# Altium project TCC01.PrjPcb
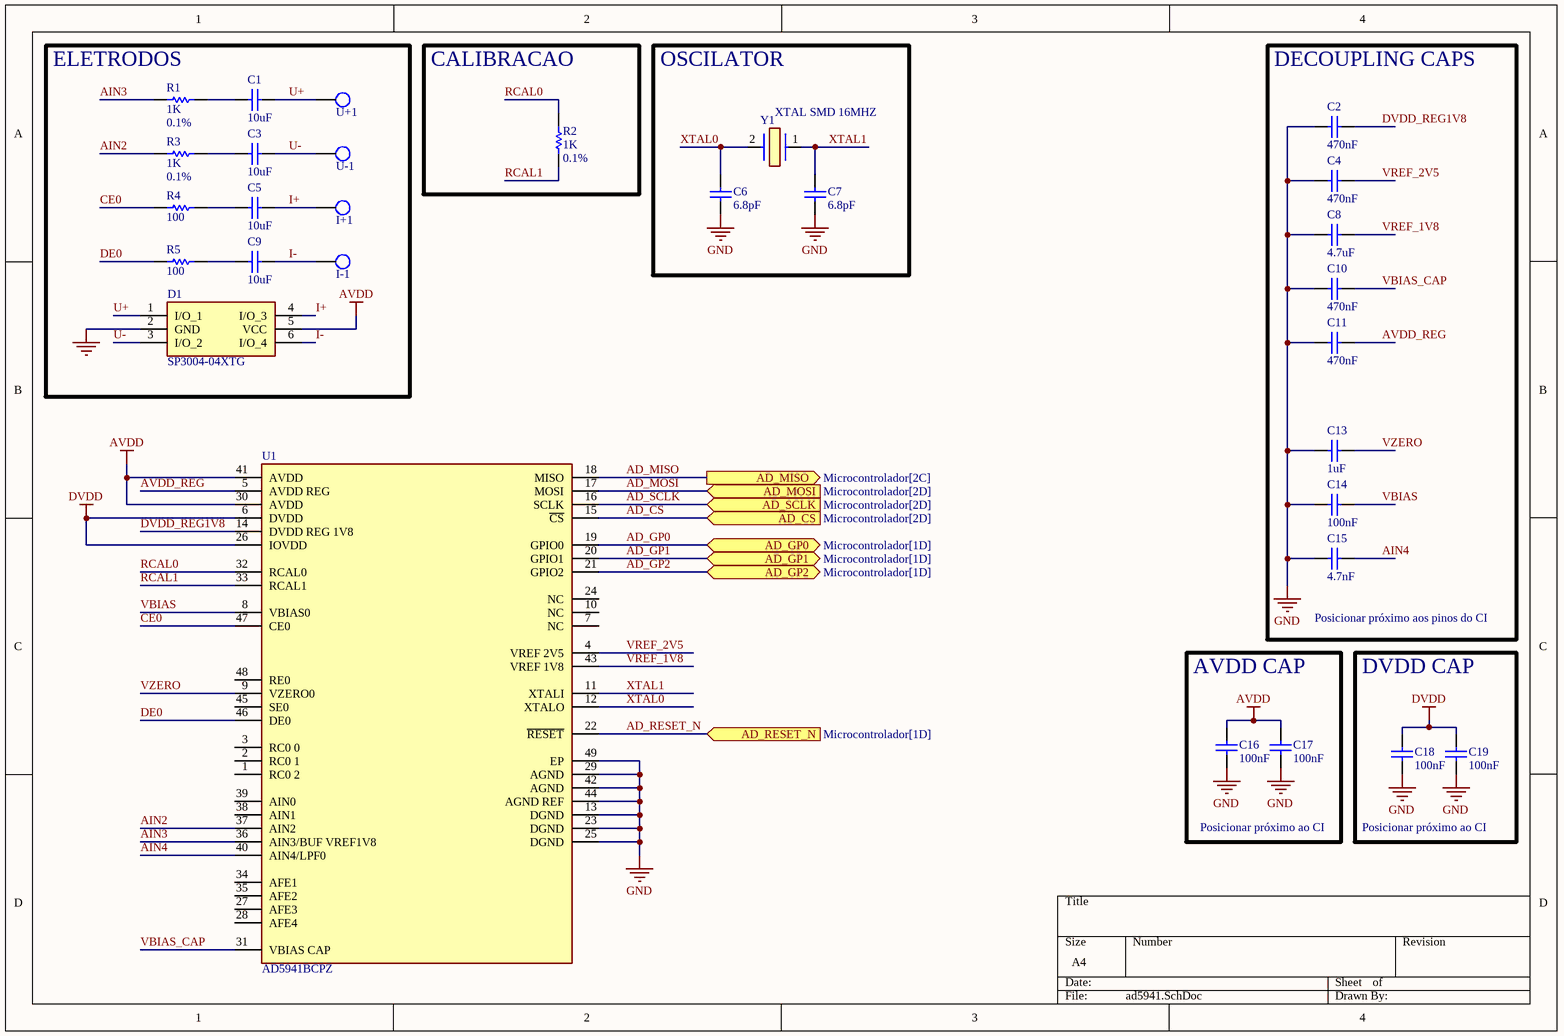
[diagram p0: ad5941.SchDoc]
2 sheets, 54 parts. Net scope: flat (ports and power ports of the same name join across sheets).
Board file: PCB2_0.PcbDoc
Sheets:
  ad5941.SchDoc
  Microcontrolador.SchDoc

## Sheet ad5941.SchDoc
size A4; SheetNumber: 1; SheetTotal: 3

### Parts
C1  value 10uF  [CAP0805OK]  (hidden comment: CAP SMD CER 10UF 50V 1206)
C2  value 470nF  [CAP0805OK]  (hidden comment: CAP SMD CER 470NF 100V 0805)
C3  value 10uF  [CAP0805OK]  (hidden comment: CAP SMD CER 10UF 50V 1206)
C4  value 470nF  [CAP0805OK]  (hidden comment: CAP SMD CER 470NF 100V 0805)
C5  value 10uF  [CAP0805OK]  (hidden comment: CAP SMD CER 10UF 50V 1206)
C6  value 6.8pF  [CAP0805OK]  (hidden comment: CAP SMD CER 6.8PF 25V 0805)
C7  value 6.8pF  [CAP0805OK]  (hidden comment: CAP SMD CER 6.8PF 25V 0805)
C8  value 4.7uF  [CAP0805OK]  (hidden comment: CAP SMD CER 4.7UF 50V 0805)
C9  value 10uF  [CAP0805OK]  (hidden comment: CAP SMD CER 10UF 50V 1206)
C10  value 470nF  [CAP0805OK]  (hidden comment: CAP SMD CER 470NF 100V 0805)
C11  value 470nF  [CAP0805OK]  (hidden comment: CAP SMD CER 470NF 100V 0805)
C13  value 1uF  [CAP0805OK]  (hidden comment: CAP SMD CER 1UF 10V 0805)
C14  value 100nF  [CAP0805OK]  (hidden comment: CAP SMD CER 100NF 25V 0805)
C15  value 4.7nF  [CAP0805OK]  (hidden comment: CAP SMD CER 4.7NF 25V 0805)
C16  value 100nF  [CAP0805OK]  (hidden comment: CAP SMD CER 100NF 25V 0805)
C17  value 100nF  [CAP0805OK]  (hidden comment: CAP SMD CER 100NF 25V 0805)
C18  value 100nF  [CAP0805OK]  (hidden comment: CAP SMD CER 100NF 25V 0805)
C19  value 100nF  [CAP0805OK]  (hidden comment: CAP SMD CER 100NF 25V 0805)
D1  SP3004-04XTG  [SOTFL50P160X60-6N]
I+1  I+  [TEST POINT]  (value not drawn)
I-1  I-  [TEST POINT]  (value not drawn)
R1  value 1K  Tolerance: 0.1%  [res0805ok]  (hidden comment: RES SMD 1K6 0.1% 0805)
R2  value 1K  Tolerance: 0.1%  [res0805ok]  (hidden comment: RES SMD 1K 1% 0805)
R3  value 1K  Tolerance: 0.1%  [res0805ok]  (hidden comment: RES SMD 1K6 0.1% 0805)
R4  value 100  [res0805ok]  (hidden comment: RES SMD 100R 1% 0805)
R5  value 100  [res0805ok]  (hidden comment: RES SMD 100R 1% 0805)
U1  AD5941BCPZ  [FP-CP-48-4-IPC_A]
U+1  U+  [TEST POINT]  (value not drawn)
U-1  U-  [TEST POINT]  (value not drawn)
Y1  XTAL SMD 16MHZ  [XTAL SMD 16MHZ]

### Blocks framed on the sheet
ELETRODOS: C1 C3 C5 C9 D1 I+1 I-1 R1 R3-R5 U+1 U-1
CALIBRACAO: R2
OSCILATOR: C6 C7 Y1
DECOUPLING CAPS: C2 C4 C8 C10 C11 C13-C15
AVDD CAP: C16 C17
DVDD CAP: C18 C19

### Ports
AD_CS (in, see Microcontrolador[2D]), AD_GP0 (bidir, see Microcontrolador[1D]), AD_GP1 (bidir, see Microcontrolador[1D]), AD_GP2 (bidir, see Microcontrolador[1D]), AD_MISO (out, see Microcontrolador[2C]), AD_MOSI (in, see Microcontrolador[2D]), AD_RESET_N (in, see Microcontrolador[1D]), AD_SCLK (in, see Microcontrolador[2D])

### Nets
AVDD: C16.1 C17.1 D1.5(VCC) U1.30(AVDD) U1.41(AVDD)
DVDD: C18.1 C19.1 U1.6(DVDD) U1.26(IOVDD)
GND: C2.1 C4.1 C6.2 C7.2 C8.1 C10.1 C11.1 C13.1 C14.2 C15.2 C16.2 C17.2 C18.2 C19.2 D1.2(GND) U1.13(DGND) U1.23(DGND) U1.25(DGND) U1.29(AGND) U1.42(AGND) U1.44(AGND_REF) U1.49(EP)
AD_CS: U1.15(~{CS}) ; port AD_CS
AD_GP0: U1.19(GPIO0) ; port AD_GP0
AD_GP1: U1.20(GPIO1) ; port AD_GP1
AD_GP2: U1.21(GPIO2) ; port AD_GP2
AD_MISO: U1.18(MISO) ; port AD_MISO
AD_MOSI: U1.17(MOSI) ; port AD_MOSI
AD_RESET_N: U1.22(~{RESET}) ; port AD_RESET_N
AD_SCLK: U1.16(SCLK) ; port AD_SCLK
AIN2: R3.1 U1.37(AIN2)
AIN3: R1.1 U1.36(AIN3/BUF_VREF1V8)
AIN4: C15.1 U1.40(AIN4/LPF0)
AVDD_REG: C11.2 U1.5(AVDD_REG)
CE0: R4.1 U1.47(CE0)
DE0: R5.1 U1.46(DE0)
DVDD_REG1V8: C2.2 U1.14(DVDD_REG_1V8)
I+: C5.2 D1.4(I/O_3) I+1.0
I-: C9.2 D1.6(I/O_4) I-1.0
RCAL0: R2.2 U1.32(RCAL0)
RCAL1: R2.1 U1.33(RCAL1)
U+: C1.2 D1.1(I/O_1) U+1.0
U-: C3.2 D1.3(I/O_2) U-1.0
VBIAS: C14.1 U1.8(VBIAS0)
VBIAS_CAP: C10.2 U1.31(VBIAS_CAP)
VREF_1V8: C8.2 U1.43(VREF_1V8)
VREF_2V5: C4.2 U1.4(VREF_2V5)
VZERO: C13.2 U1.9(VZERO0)
XTAL0: C6.1 U1.12(XTALO) Y1.2
XTAL1: C7.1 U1.11(XTALI) Y1.1
NetC1_1: C1.1 R1.2
NetC3_1: C3.1 R3.2
NetC5_1: C5.1 R4.2
NetC9_1: C9.1 R5.2

Not connected (* = marked no-connect by the designer): U1 1(RC0_2) 2(RC0_1) 3(RC0_0) 7(NC) 10(NC) 24(NC) 27(AFE3) 28(AFE4) 34(AFE1) 35(AFE2) 38(AIN1) 39(AIN0) 45(SE0) 48(RE0)

### Notes on the sheet
- Posicionar próximo aos pinos do CI
- Posicionar próximo ao CI

### Library data of the parts
C1 C3 C5 C9 = CAP SMD CER 10UF 10V 0805: Multilayer Ceramic Capacitors MLCC - SMD/SMT 10 uF 10 VDC 10% 0805 X7R; COD. CRISTOFOLI: EMP.00322; Tolerance: 20%; List: CAP CER 10UF 50V X5R 1206/UMK316BBJ106ML-T/Generic; Voltage: 50V; Type: CERAMIC
C2 C4 C10 C11 = CAP SMD CER 470NF 100V 0805: COD. CRISTOFOLI: EMP.00245; Tolerance: 10%; List: CAP CER 0.47UF 100V 10% X7R 0805/GRM21BR72A474KA73L/Murata Electronics North America; Type: CERAMIC; Voltage: 100V
C6 C7 C14-C19 = CAP SMD CER 100NF 25V 0805: COD. CRISTOFOLI: EMP.00094; Tolerance: 10%; List: CAP CER 0.1UF 25V 10% X7R 0805/CGJ4J2X7R1E104K125AA/TDK; Type: CERAMIC; Voltage: 25V
C8 = CAP SMD CER 4.7UF 50V 0805: COD. CRISTOFOLI: EMP.00333; Tolerance: 10%; List: CAP CER 4.7UF 50V X5R 0805/CL21A475KBQNNNE/Samsung; Type: CERAMIC; Voltage: 50V
C13 = CAP SMD CER 1UF 10V 0805: COD. CRISTOFOLI: EMP.00209; Tolerance: 20%; List: CAP- SMD/SMT X7R 0805 10V 1uF 20%/LMK212BJ105MG-T/Taiyo Yuden; Type: CERAMIC; Voltage: 10V
D1 = SP3004-04XTG: TVS Diode (Uni-directional); Manufacturer_Name: LITTELFUSE; Datasheet Link: https://m.littelfuse.com/~/media/electronics/datasheets/tvs_diode_arrays/littelfuse_tvs_diode_array_sp3004_datasheet.pdf.pdf; Height: 0.6mm; Manufacturer_Part_Number: SP3004-04XTG; Mouser Part Number: 576-SP3004-04XTG; Mouser Price/Stock: https://www.mouser.co.uk/ProductDetail/Littelfuse/SP3004-04XTG?qs=trbuaetfxXQ7JjseAkJ3Ww%3D%3D; Arrow Part Number: SP3004-04XTG; Arrow Price/Stock: https://www.arrow.com/en/products/sp3004-04xtg/littelfuse?region=nac
I+1 I-1 U+1 U-1 = TEST POINT
R1 R3 = RES SMD 1K6 0.1% 0805: COD. CRISTOFOLI: EMP.00204; List: RES 1.6K OHM 1/8W .1% 0805 SMD/ERA-6AEB162V/Panasonic Electronic Components/Generic
R2 = RES SMD 1K 1% 0805: COD. CRISTOFOLI: EMP.50098; List: RES SMD 1K 1% 0805
R4 R5 = RES SMD 10R 1% 0805: COD. CRISTOFOLI: EMP.50001; List: RES SMD 10R 1% 0805; Tolerance: 1%
U1 = CMP-09085-000021-2: BIO-IMPEDANCE & ELECTROCHEMICAL; RoHS Compliant: Yes
Y1 = XTAL SMD 16MHZ: Crystal or Oscillator; Manufacturer_Name: Vishay; Manufacturer_Part_Number: XT9M20ANA16M; Datasheet Link: https://componentsearchengine.com/Datasheets/5/XT9M20ANA16M.pdf; Height: 4.5mm; Mouser Part Number: 73-XT49M1600-20; Mouser Price/Stock: https://www.mouser.co.uk/ProductDetail/Vishay-Dale/XT9M20ANA16M?qs=NVJATC80C4%252B3oEpMmPFr7g%3D%3D; Arrow Part Number: XT9M20ANA16M; Arrow Price/Stock: https://www.arrow.com/en/products/xt9m20ana16m/vishay?region=nac

## Sheet Microcontrolador.SchDoc
size A4; SheetNumber: 3; SheetTotal: 3
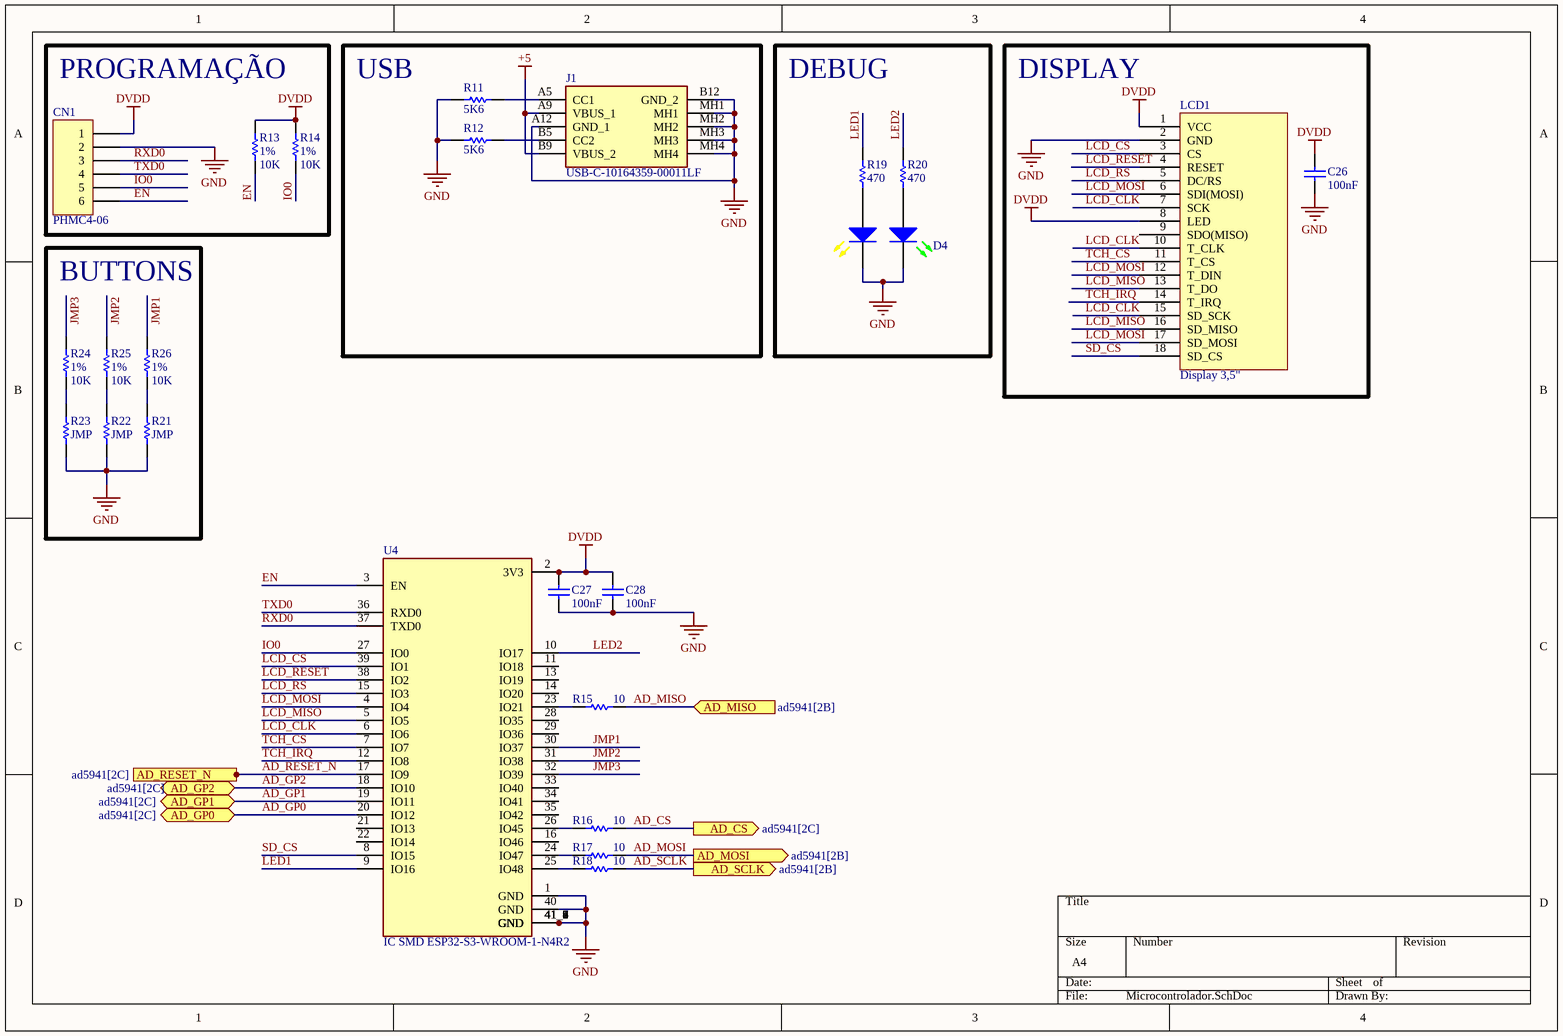
[diagram p1: Microcontrolador.SchDoc]

### Parts
C26  value 100nF  [CAP0805OK]  (hidden comment: CAP SMD CER 100NF 25V 0805)
C27  value 100nF  [CAP0805OK]  (hidden comment: CAP SMD CER 100NF 25V 0805)
C28  value 100nF  [CAP0805OK]  (hidden comment: CAP SMD CER 100NF 25V 0805)
CN1  CN MAC 6 VIAS 180º 2.54MM  [PHMC4-06]  (value not drawn)
D4  LED SMD DUAL  [LTST-C197]  (value not drawn)
J1  USB-C-10164359-00011LF  [USB-C-1016435900011LF]
LCD1  Display 3,5"  [Display_3.5"_SPI_480X320]
R11  value 5K6  [res0805ok]  (hidden comment: RES SMD 5K6 1% 0805)
R12  value 5K6  [res0805ok]  (hidden comment: RES SMD 5K6 1% 0805)
R13  value 10K  Tolerance: 1%  [res0805ok]  (hidden comment: RES SMD 10K 1% 0805)
R14  value 10K  Tolerance: 1%  [res0805ok]  (hidden comment: RES SMD 10K 1% 0805)
R15  value 10  [res0805ok]  (hidden comment: RES SMD 10 1% 0805)
R16  value 10  [res0805ok]  (hidden comment: RES SMD 10 1% 0805)
R17  value 10  [res0805ok]  (hidden comment: RES SMD 10 1% 0805)
R18  value 10  [res0805ok]  (hidden comment: RES SMD 10 1% 0805)
R19  value 470  [res0805ok]  (hidden comment: RES SMD 1K 1% 0805)
R20  value 470  [res0805ok]  (hidden comment: RES SMD 1K 1% 0805)
R21  value JMP  [JMP0805]  (hidden comment: RES SMD 10K 1% 0805)
R22  value JMP  [JMP0805]  (hidden comment: RES SMD 10K 1% 0805)
R23  value JMP  [JMP0805]  (hidden comment: RES SMD 10K 1% 0805)
R24  value 10K  Tolerance: 1%  [res0805ok]  (hidden comment: RES SMD 10K 1% 0805)
R25  value 10K  Tolerance: 1%  [res0805ok]  (hidden comment: RES SMD 10K 1% 0805)
R26  value 10K  Tolerance: 1%  [res0805ok]  (hidden comment: RES SMD 10K 1% 0805)
U4  IC SMD ESP32-S3-WROOM-1-N4R2  [XCVR_ESP32-S3-WROOM-1-N4R2]

### Blocks framed on the sheet
PROGRAMAÇÃO: CN1 R13 R14
USB: J1 R11 R12
DEBUG: D4 R19 R20
DISPLAY: C26 LCD1
BUTTONS: R21-R26

### Ports
AD_CS (out, see ad5941[2C]), AD_GP0 (bidir, see ad5941[2C]), AD_GP1 (bidir, see ad5941[2C]), AD_GP2 (bidir, see ad5941[2C]), AD_MISO (in, see ad5941[2B]), AD_MOSI (out, see ad5941[2B]), AD_RESET_N (out, see ad5941[2C]), AD_SCLK (out, see ad5941[2B])

### Nets
+5: J1.A9(VBUS_1) J1.B9(VBUS_2)
DVDD: C26.2 C27.1 C28.1 CN1.1 LCD1.1(VCC) LCD1.8(LED) R13.2 R14.2 U4.2(3V3)
GND: C26.1 C27.2 C28.2 CN1.2 D4.3(K) D4.4(K) J1.A12(GND_1) J1.B12(GND_2) J1.MH1 J1.MH2 J1.MH3 J1.MH4 LCD1.2(GND) R11.2 R12.2 R21.2 R22.2 R23.2 U4.1(GND) U4.40(GND) U4.41_1(GND) U4.41_2(GND) U4.41_3(GND) U4.41_4(GND) U4.41_5(GND) U4.41_6(GND) U4.41_7(GND) U4.41_8(GND) U4.41_9(GND)
AD_CS: R16.1 ; port AD_CS
AD_GP0: U4.20(IO12) ; port AD_GP0
AD_GP1: U4.19(IO11) ; port AD_GP1
AD_GP2: U4.18(IO10) ; port AD_GP2
AD_MISO: R15.1 ; port AD_MISO
AD_MOSI: R17.1 ; port AD_MOSI
AD_RESET_N: U4.17(IO9) ; port AD_RESET_N
AD_SCLK: R18.1 ; port AD_SCLK
EN: CN1.6 R13.1 U4.3(EN)
IO0: CN1.5 R14.1 U4.27(IO0)
JMP1: R26.2 U4.30(IO37)
JMP2: R25.2 U4.31(IO38)
JMP3: R24.2 U4.32(IO39)
LCD_CLK: LCD1.7(SCK) LCD1.10(T_CLK) LCD1.15(SD_SCK) U4.6(IO6)
LCD_CS: LCD1.3(CS) U4.39(IO1)
LCD_MISO: LCD1.13(T_DO) LCD1.16(SD_MISO) U4.5(IO5)
LCD_MOSI: LCD1.6(SDI(MOSI)) LCD1.12(T_DIN) LCD1.17(SD_MOSI) U4.4(IO4)
LCD_RESET: LCD1.4(RESET) U4.38(IO2)
LCD_RS: LCD1.5(DC/RS) U4.15(IO3)
LED1: R19.2 U4.9(IO16)
LED2: R20.2 U4.10(IO17)
RXD0: CN1.3 U4.37(TXD0)
SD_CS: LCD1.18(SD_CS) U4.8(IO15)
TCH_CS: LCD1.11(T_CS) U4.7(IO7)
TCH_IRQ: LCD1.14(T_IRQ) U4.12(IO8)
TXD0: CN1.4 U4.36(RXD0)
NetD4_1: D4.1(A) R20.1
NetD4_2: D4.2(A) R19.1
NetJ1_A5: J1.A5(CC1) R11.1
NetJ1_B5: J1.B5(CC2) R12.1
NetR15_2: R15.2 U4.23(IO21)
NetR16_2: R16.2 U4.26(IO45)
NetR17_2: R17.2 U4.24(IO47)
NetR18_2: R18.2 U4.25(IO48)
NetR21_1: R21.1 R26.1
NetR22_1: R22.1 R25.1
NetR23_1: R23.1 R24.1

Not connected (* = marked no-connect by the designer): LCD1 9(SDO(MISO)); U4 11(IO18) 13(IO19) 14(IO20) 16(IO46) 21(IO13) 22(IO14) 28(IO35) 29(IO36) 33(IO40) 34(IO41) 35(IO42)

### Library data of the parts
C26-C28 = CAP SMD CER 100NF 25V 0805: as C6 on sheet ad5941; Voltage: 25V
CN1 = CN MAC 6 VIAS 180º 2.54MM: gravação micro; Manufacturer: METALTEX; COD. CRISTOFOLI: EMP.00436; List: Barra de pinos Macho 180° / BPSC-03 / metaltex; Manufacturer Part Number: PHMC4-06
D4 = LED SMD DUAL: COD. CRISTOFOLI: EMP.00010; List: LED - SMD WHITE CLEAR NON-DIFF - SUN LED XZCWD105S / EVERLIGHT 67-21UKC/S3282/TR8-D ( descontinuado) //67-21S/KK2C-H6565M41N42936Z6/2T; Value: BRANCO
J1 = USB-C-10164359-00011LF: Connector; Manufacturer_Name: Amphenol; Datasheet Link: https://cdn.amphenol-cs.com/media/wysiwyg/files/drawing/10164359.pdf; Height: 3.41mm; Manufacturer_Part_Number: 10164359-00011LF; Mouser Part Number: 649-10164359-00011LF; Mouser Price/Stock: https://www.mouser.co.uk/ProductDetail/Amphenol-FCI/10164359-00011LF?qs=MyNHzdoqoQLpQ%2FmSqA1%252BtQ%3D%3D; Arrow Part Number: 10164359-00011LF; Arrow Price/Stock: https://www.arrow.com/en/products/10164359-00011lf/amphenol-fci?region=nac
LCD1 = Display 3,5" SPI: Display TFT SPI 480X320; COD. CRISTOFOLI: EMP.00435; List: Display TFT 3.5" SPI 480X320 MSP3520; Documentações: http://www.lcdwiki.com/3.5inch_SPI_Module_ILI9488_SKU:MSP3520; Datasheet: http://www.lcdwiki.com/res/MSP3520/3.5inch_SPI_Module_MSP3520_User_Manual_EN.pdf
R11-R18 R21-R26 = RES SMD 10K 1% 0805: COD. CRISTOFOLI: EMP.50116; List: RES SMD 10K 1% 0805
  R11 R12 R15-R18 R21-R23: Tolerance: 1%
R19 R20 = RES SMD 1K 1% 0805: COD. CRISTOFOLI: EMP.50098; List: RES SMD 1K 1% 0805; Tolerance: 1%
U4 = IC SMD ESP32-S3-WROOM-1-N4R2: Bluetooth, WiFi 802.11b/g/n, Bluetooth v5.0 Transceiver Module 2.4GHz PCB Trace Surface Mount; MF: Espressif Systems; COD. CRISTOFOLI: EMP.50161; Package: None; Purchase-URL: https://pricing.snapeda.com/search/part/ESP32-S3-WROOM-1-N4R2/?ref=eda; Price: None; Availability: In Stock; Check_prices: https://www.snapeda.com/parts/ESP32-S3-WROOM-1-N4R2/Espressif+Systems/view-part/?ref=eda; MP: ESP32-S3-WROOM-1-N4R2; SnapEDA_Link: https://www.snapeda.com/parts/ESP32-S3-WROOM-1-N4R2/Espressif+Systems/view-part/?ref=snap; Value: *; List: IC SMD ESP32-S3-WROOM-1-N4R2

## Nets that join several sheets
DVDD: ad5941 (C18.1 C19.1 U1.6 U1.26), Microcontrolador (9 pins)
GND: ad5941 (22 pins), Microcontrolador (29 pins)
AD_CS: ad5941 (U1.15), Microcontrolador (R16.1)
AD_GP0: ad5941 (U1.19), Microcontrolador (U4.20)
AD_GP1: ad5941 (U1.20), Microcontrolador (U4.19)
AD_GP2: ad5941 (U1.21), Microcontrolador (U4.18)
AD_MISO: ad5941 (U1.18), Microcontrolador (R15.1)
AD_MOSI: ad5941 (U1.17), Microcontrolador (R17.1)
AD_RESET_N: ad5941 (U1.22), Microcontrolador (U4.17)
AD_SCLK: ad5941 (U1.16), Microcontrolador (R18.1)